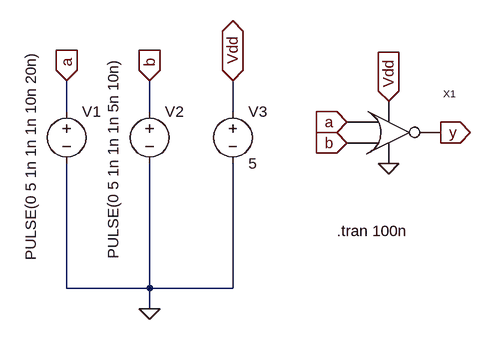
[diagram p0: schematic norsim.asc]
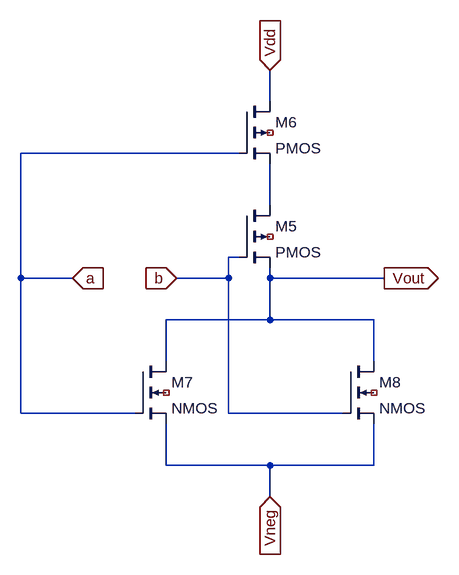
[diagram p1: sub-circuit norsymb.asc]
norsim.asc, the LTspice schematic file:
Version 4
SHEET 1 880 680
WIRE -112 224 -112 176
WIRE 16 224 16 176
WIRE 144 224 144 176
WIRE -112 496 -112 304
WIRE 16 496 16 304
WIRE 16 496 -112 496
WIRE 144 496 144 304
WIRE 144 496 16 496
WIRE 16 528 16 496
FLAG 16 528 0
FLAG -112 176 a
IOPIN -112 176 In
FLAG 16 176 b
IOPIN 16 176 In
FLAG 144 176 Vdd
IOPIN 144 176 BiDir
FLAG 320 240 a
IOPIN 320 240 In
FLAG 320 272 b
IOPIN 320 272 In
FLAG 384 208 Vdd
IOPIN 384 208 In
FLAG 384 304 0
FLAG 464 256 y
IOPIN 464 256 Out
SYMBOL voltage -112 208 R0
WINDOW 3 -55 -79 VRight 2
SYMATTR Value PULSE(0 5 1n 1n 1n 10n 20n)
SYMATTR InstName V1
SYMBOL voltage 16 208 R0
WINDOW 3 -56 -67 VRight 2
SYMATTR Value PULSE(0 5 1n 1n 1n 5n 10n)
SYMATTR InstName V2
SYMBOL voltage 144 208 R0
SYMATTR InstName V3
SYMATTR Value 5
SYMBOL norsymb 384 256 R0
SYMATTR InstName X1
TEXT 304 408 Left 2 !.tran 100n

norsymb.asc, the sub-circuit schematic file:
Version 4
SHEET 1 1772 784
WIRE 880 -16 880 -64
WIRE 832 64 496 64
WIRE 880 144 880 80
WIRE 832 224 816 224
WIRE 496 256 496 64
WIRE 576 256 496 256
WIRE 816 256 816 224
WIRE 816 256 736 256
WIRE 880 256 880 240
WIRE 1056 256 880 256
WIRE 880 320 880 256
WIRE 880 320 720 320
WIRE 1040 320 880 320
WIRE 720 384 720 320
WIRE 1040 384 1040 320
WIRE 496 464 496 256
WIRE 672 464 496 464
WIRE 816 464 816 256
WIRE 992 464 816 464
WIRE 720 544 720 480
WIRE 880 544 720 544
WIRE 1040 544 1040 480
WIRE 1040 544 880 544
WIRE 880 592 880 544
FLAG 880 -64 Vdd
IOPIN 880 -64 In
FLAG 576 256 a
IOPIN 576 256 In
FLAG 736 256 b
IOPIN 736 256 In
FLAG 1056 256 Vout
IOPIN 1056 256 Out
FLAG 880 592 Vneg
IOPIN 880 592 In
SYMBOL pmos4 832 144 R0
SYMATTR InstName M5
SYMBOL pmos4 832 -16 R0
SYMATTR InstName M6
SYMBOL nmos4 672 384 R0
SYMATTR InstName M7
SYMBOL nmos4 992 384 R0
SYMATTR InstName M8

The netlist it stands for:
* norsim.asc
V1 a 0 PULSE(0 5 1n 1n 1n 10n 20n)
V2 b 0 PULSE(0 5 1n 1n 1n 5n 10n)
V3 Vdd 0 5
XX1 a b y Vdd 0 norsymb

* block symbol definitions
.subckt norsymb a b Vout Vdd Vneg
M5 N001 b Vout NC_01 PMOS
M6 Vdd a N001 NC_02 PMOS
M7 Vout a Vneg NC_03 NMOS
M8 Vout b Vneg NC_04 NMOS
.ends norsymb

.model NMOS NMOS
.model PMOS PMOS
.lib standard.mos
.tran 100n
.backanno
.end